# EAGLE design lat_encamp_v2 (EAGLE 9.6.2)
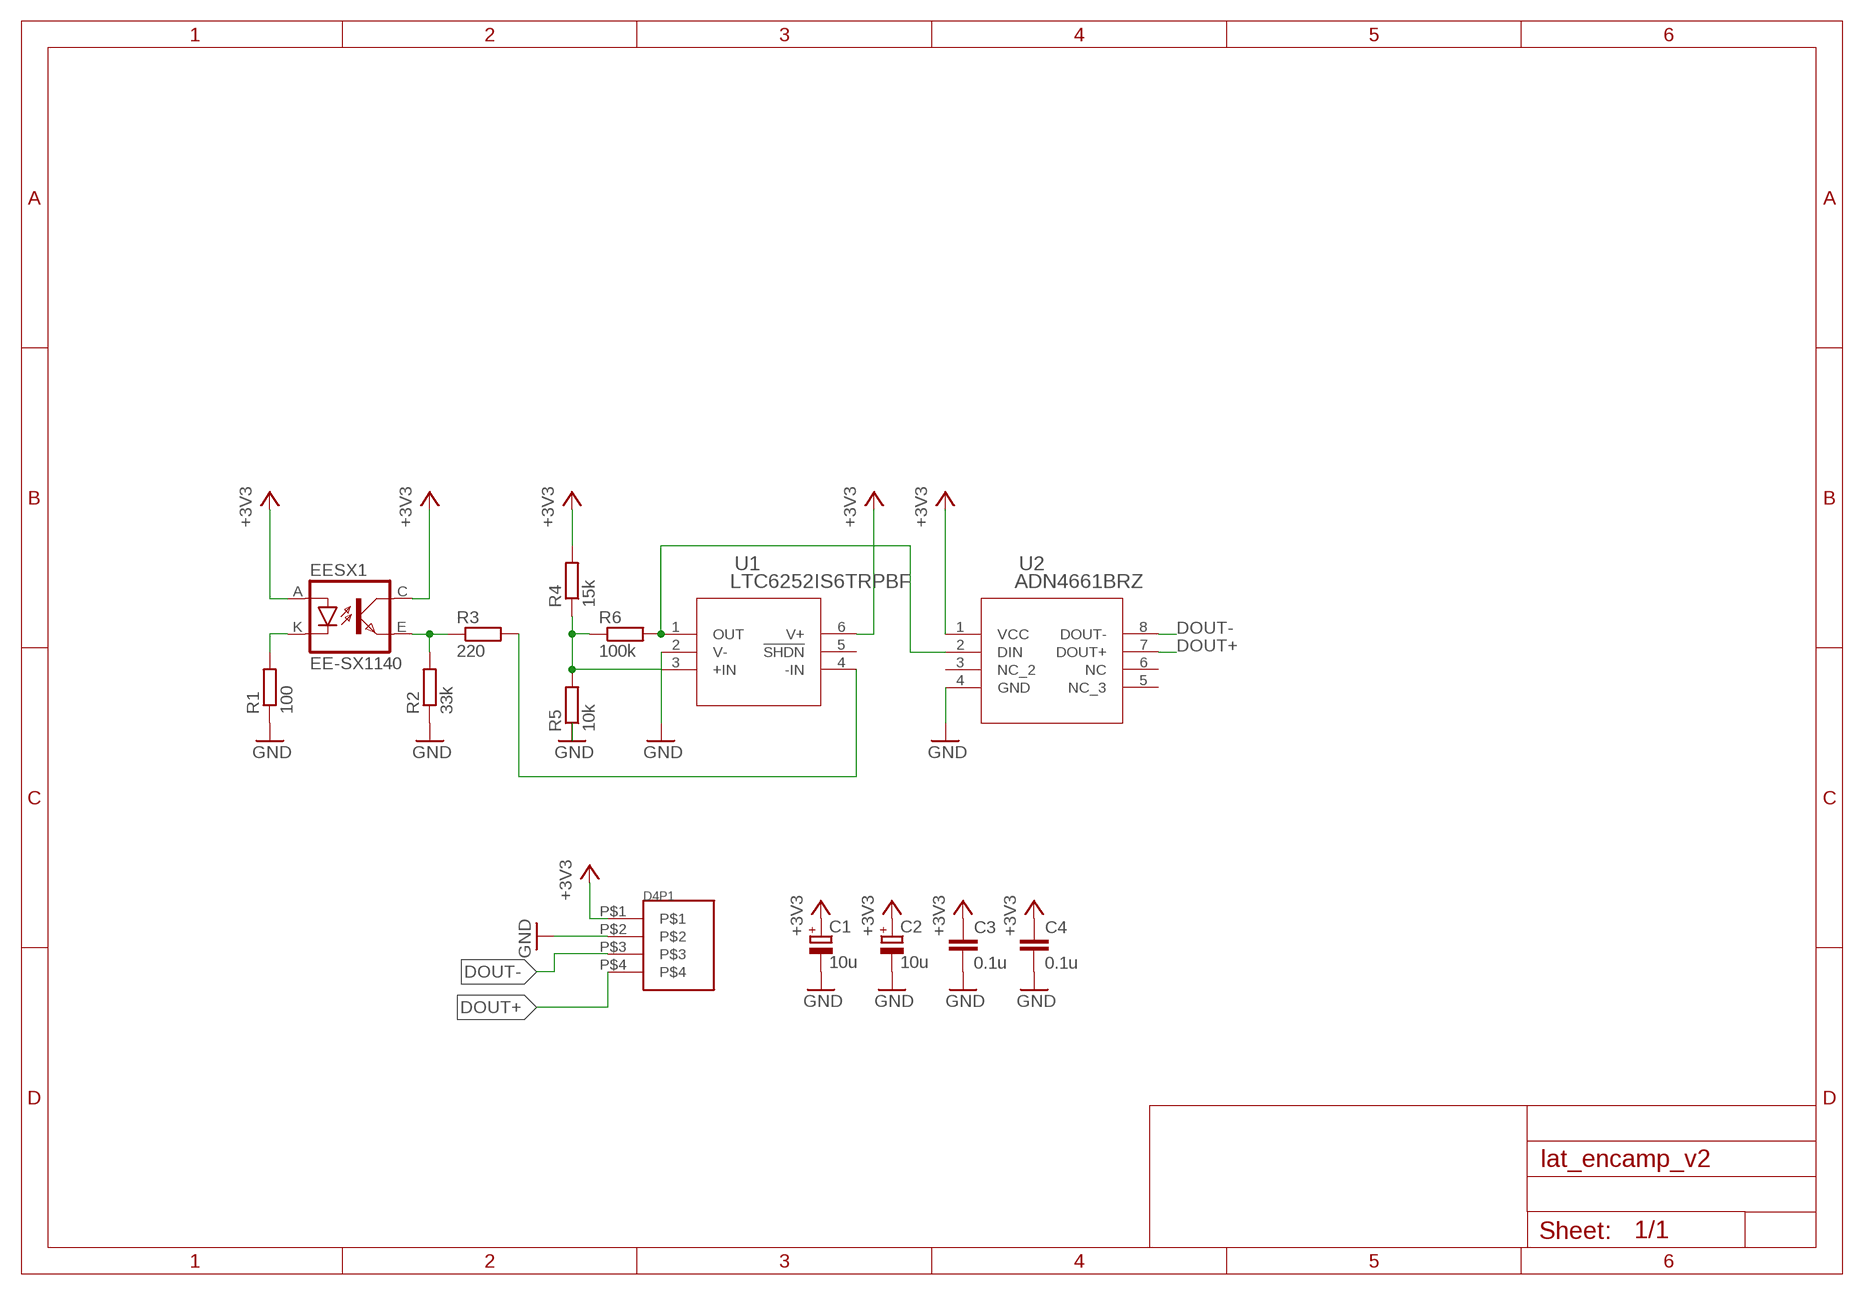
[diagram p0: schematic, sheet 1]

## Parts
C1  10u  CPOL-EUSMCA  [SMC_A]
C2  10u  CPOL-EUSMCA  [SMC_A]
C3  0.1u  C-EUC0603  [C0603]
C4  0.1u  C-EUC0603  [C0603]
D4P1  DF1E-4P  [DF1E-4P]
EESX1  EE-SX1140  [EE-SX1140]
R1  100  R-EU_R0603  [R0603]
R2  33k  R-EU_R0603  [R0603]
R3  220  R-EU_R0603  [R0603]
R4  15k  R-EU_R0603  [R0603]
R5  10k  R-EU_R0603  [R0603]
R6  100k  R-EU_R0603  [R0603]
U1  LTC6252IS6TRPBF  [TSOT-23_S6_LIT]
U2  ADN4661BRZ  [R_8_ADI]

## Nets
+3V3: C1.+ C2.+ C3.1 C4.1 D4P1.P$1 EESX1.A EESX1.C(COL) R4.2 U1.6(V+) U2.1(VCC)
DOUT+: D4P1.P$4 U2.7(DOUT+)
DOUT-: D4P1.P$3 U2.8(DOUT-)
GND: C1.- C2.- C3.2 C4.2 D4P1.P$2 R1.1 R2.1 R5.1 U1.2(V-) U2.4(GND)
N$1: R3.2 U1.4(-IN)
N$2: R6.2 U1.1(OUT) U2.2(DIN)
N$3: R4.1 R5.2 R6.1 U1.3(+IN)
N$4: EESX1.E(EMIT) R2.2 R3.1
N$5: EESX1.K(C) R1.2
Unconnected: U1.5(!SHDN) U2.3(NC_2) U2.5(NC_3) U2.6(NC)

## Library data of the parts
C1 C2 = rcl:CPOL-EU: POLARIZED CAPACITOR, European symbol; SPICEPREFIX: C
C3 C4 = rcl:C-EU: CAPACITOR, European symbol; SPICEPREFIX: C
D4P1 = lib_test:DF1E-4P
EESX1 = lib_test:EE-SX1140
R1-R6 = rcl:R-EU_: RESISTOR, European symbol; SPICEPREFIX: R
U1 = lib_test:LTC6252IS6TRPBF; BUILT_BY: EMA_UL_Team; MANUFACTURER_PART_NUMBER: LTC6252IS6#TRPBF; SOURCELIBRARY: LinearTech_2016-05-13_4; VENDOR: Linear Technology
U2 = lib_test:ADN4661BRZ; BUILT_BY: EMA_UL_Team; MANUFACTURER_PART_NUMBER: ADN4661BRZ; SOURCELIBRARY: Analog_2012-01-01_8; VENDOR: Analog Devices Inc

## Board
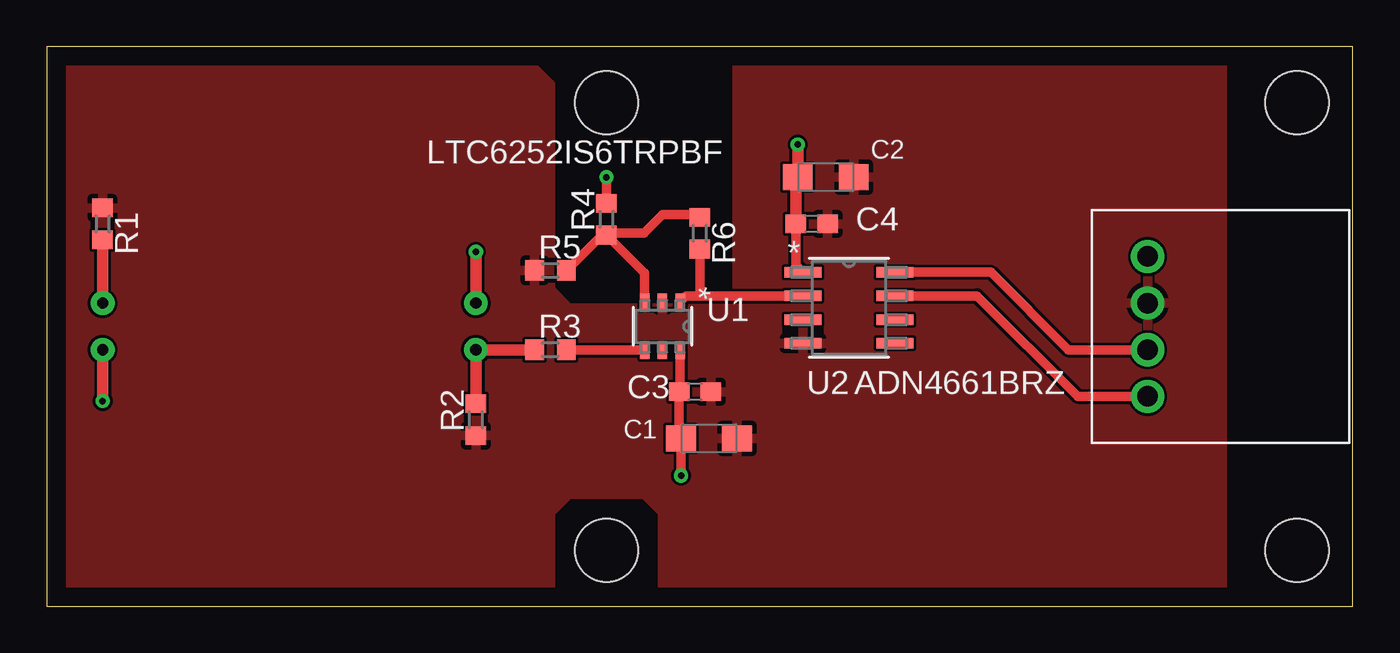
[diagram p1: board, top side]
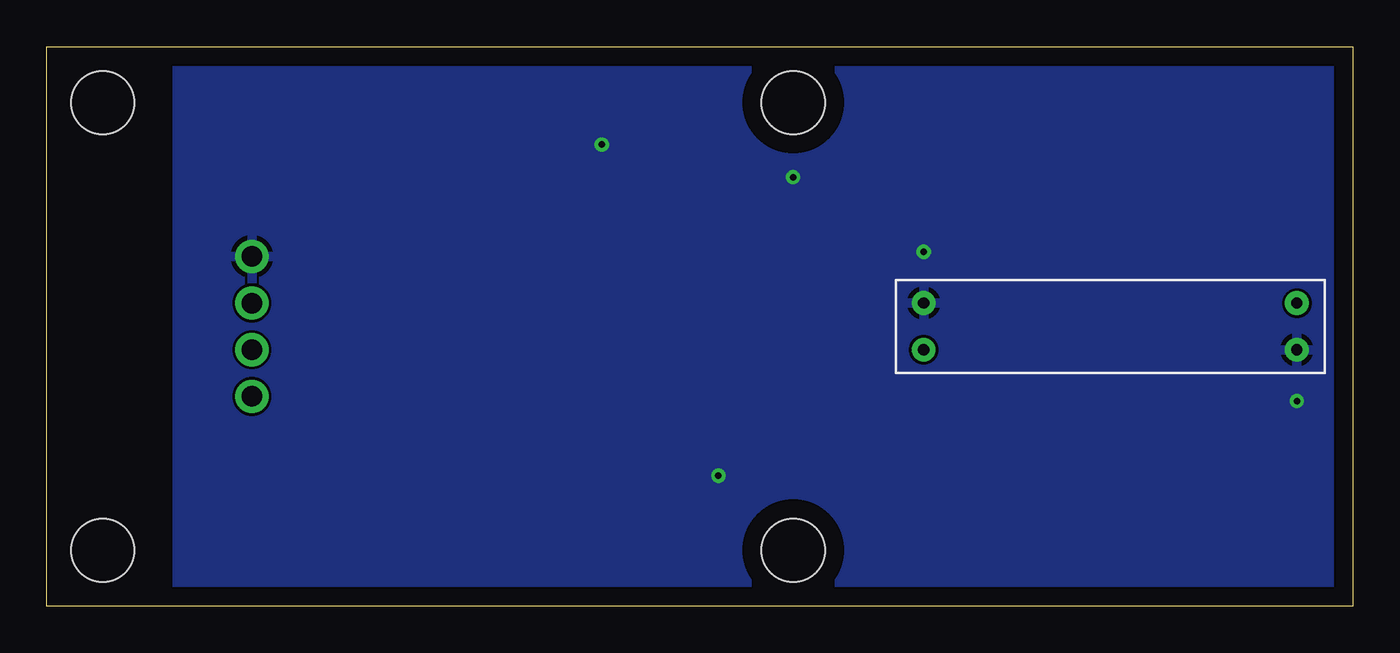
[diagram p2: board, bottom side, seen from below]

Size 70 x 30 mm. Coordinates in mm from the lower left corner, seen from the top.
Outline: 0,0 70,0 70,30 0,30 0,0
Copper layers (1*16): Top 0.035mm / dielectric 1.5mm / Bottom 0.035mm
Design rules "default": minimum track width 6mil, minimum drill 0.35mm, track to track 6mil, track to pad 6mil, pad to pad 6mil, via to via 6mil, smd to smd 6mil, copper to edge 40mil, drill to drill 6mil, minimum pad ring 10mil, minimum via ring 8mil, stop-mask expansion 4mil, vias tented up to drill 0mil, thermal gap 10mil
Holes 3.4 mm at 67,27 67,3 30,27 30,3

### Footprints (pad centres in the part's own frame; a part is rotated, then mirrored left to right if it is on the bottom)
SMC_A = smd 1.6 x 1.4: + -1.5,0; - 1.5,0
C0603 = smd 1.1 x 1: 1 -0.85,0; 2 0.85,0
DF1E-4P = drill 1.1 pad 1.778: P$1 0,3.75; P$2 0,1.25; P$3 0,-1.25; P$4 0,-3.75
EE-SX1140 = drill 0.6 pad 1.27: A 1.25,10; C -1.25,-10; E 1.25,-10; K -1.25,10
R0603 = smd 1 x 1.1: 1 -0.85,0; 2 0.85,0
TSOT-23_S6_LIT = smd 0.876 x 0.508: 1 -1.314,0.95; 2 -1.314,0; 3 -1.314,-0.95; 4 1.314,-0.95; 5 1.314,0; 6 1.314,0.95
R_8_ADI = smd 1.981 x 0.559: 1 -2.464,1.905; 2 -2.464,0.635; 3 -2.464,-0.635; 4 -2.464,-1.905; 5 2.464,-1.905; 6 2.464,-0.635; 7 2.464,0.635; 8 2.464,1.905

### Placement (x,y rotation side)
C1  35.5,9 0 top
C2  41.75,23 0 top
C3  34.75,11.5 0 top
C4  41,20.5 0 top
D4P1  59,15 0 top
EESX1  13,15 270 bottom
R1  3,20.5 270 top
R2  23,10 90 top
R3  27,13.75 0 top
R4  30,20.75 90 top
R5  27,18 0 top
R6  35,20 270 top
U1  33,15 270 top
U2  43,16 0 top

### Tracks (layer width: path | path; a pad name or v marks a point on that pad's centre or on a via)
+3V3  (via drill 0.35)
  Top 0.508: U1.6 33.95,11.55 C3.1 33.9,9.1 C1.+ v34,7 | R4.2 v30,23 | U2.1 40.15,18.29 C4.1
  Top 0.61: EESX1.A v3,11 | EESX1.C v23,19 | C4.1 40.15,22.9 C2.+ v40.25,24.75
  pour Bottom: 0,30 0,0 63,0 63,30
DOUT+
  Top 0.508: U2.7 49.87,16.64 55.25,11.25 D4P1.P$4
DOUT-
  Top 0.508: U2.8 50.59,17.91 54.75,13.75 D4P1.P$3
GND
  pour Top: 0,30 0,0 26,0 27,1 27,5 28,6 32,6 33,5 33,1 34,0 63,0 63,30 38,30 37,29 37,16 28,16 27,17 27,20 27,28 25,30
N$1
  Top 0.508: R3.2 31.99,13.75 U1.4
N$2
  Top 0.508: U1.1 34.27,16.64 35,16.64 | 35,16.64 U2.2 | R6.2 35,16.64
N$3
  Top 0.508: R4.1 30.1,20 32,20 33,21 34.85,21 R6.1 | R5.2 29.75,19.9 R4.1 | R4.1 32.05,17.85 U1.3
N$4
  Top 0.61: R2.2 EESX1.E R3.1
N$5
  Top 0.61: EESX1.K R1.2